# EasyEDA schematic SCH_New-Project_2024-05-19.json
TITLE: Sheet_1; REV: 1.0; Date: 2024-03-19; Sheet: 1/1; Drawn By: qwsa1223; Company: Your Company
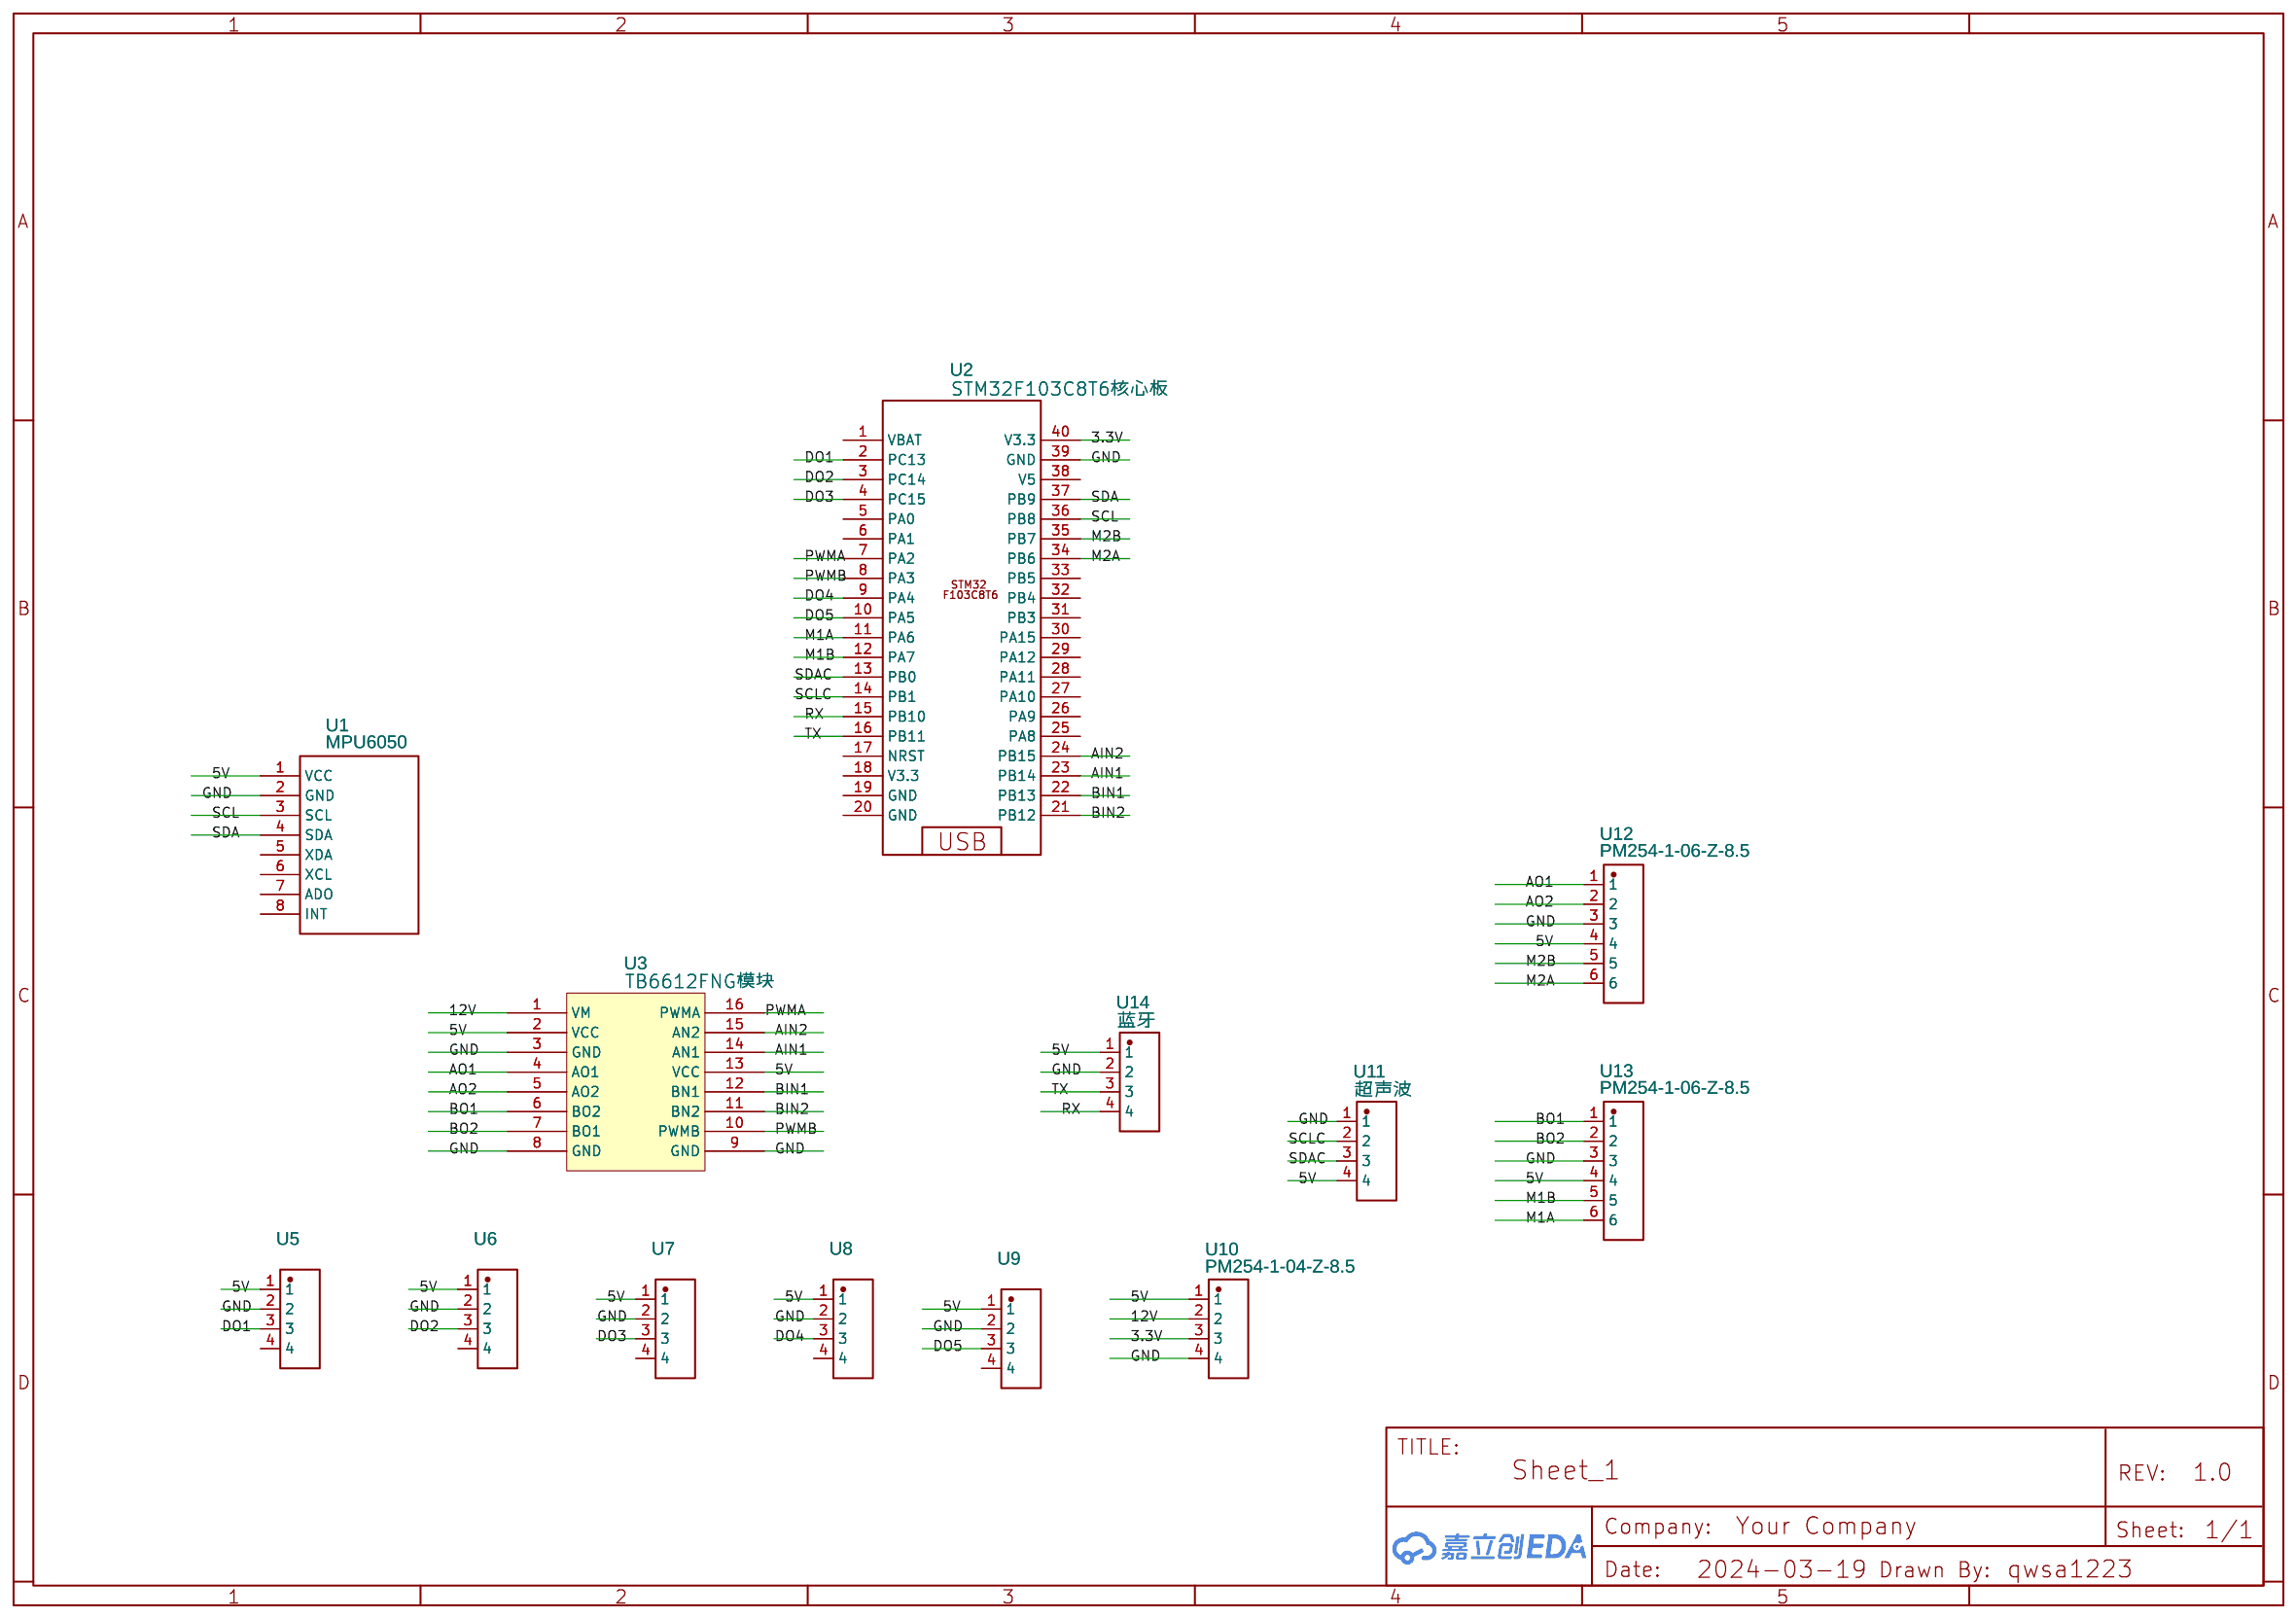
[diagram p0: schematic sheet]

## Parts
U1  MPU6050  [MPU6050]
U2  STM32F103C8T6核心板  [STM32F103C8T6核心板]
U3  TB6612FNG模块  [TB6612FNC]
U5  PM254-1-04-W-8.5  [HDR-TH_4P-P2.54-H-F-W10.0-N]
U6  PM254-1-04-W-8.5  [HDR-TH_4P-P2.54-H-F-W10.0-N]
U7  PM254-1-04-W-8.5  [HDR-TH_4P-P2.54-H-F-W10.0-N]
U8  PM254-1-04-W-8.5  [HDR-TH_4P-P2.54-H-F-W10.0-N]
U9  PM254-1-04-W-8.5  [HDR-TH_4P-P2.54-H-F-W10.0-N]
U10  PM254-1-04-Z-8.5  [HDR-TH_4P-P2.54-V-F]
U11  超声波  [HDR-TH_4P-P2.54-V-F]
U12  PM254-1-06-Z-8.5  [HDR-TH_6P-P2.54-V-F]
U13  PM254-1-06-Z-8.5  [HDR-TH_6P-P2.54-V-F]
U14  蓝牙  [HDR-TH_4P-P2.54-V-F]

## Library data of the parts
U1 = MPU6050: Contributor: LIbaiMaotai
U2 = STM32F103C8T6核心板: Contributor: Joe0011
U3 = TB6612FNG模块: Contributor: dxydxy
U5-U9 = PM254-1-04-W-8.5: Contributor: LCSC; Supplier: LCSC; Supplier Part: C2897386; Manufacturer: HCTL(华灿天禄); JLCPCB Part Class: Extended Part
U10 U11 U14 = PM254-1-04-Z-8.5: Contributor: LCSC; Supplier: LCSC; Supplier Part: C2897367; Manufacturer: HCTL(华灿天禄); JLCPCB Part Class: Extended Part
U12 U13 = PM254-1-06-Z-8.5: Contributor: LCSC; Supplier: LCSC; Supplier Part: C2897369; Manufacturer: HCTL(华灿天禄); JLCPCB Part Class: Extended Part

## Nets
3.3V: U2.40(V3.3) U10.3
5V: U1.1(VCC) U3.2(VCC) U3.13(VCC) U5.1 U6.1 U7.1 U8.1 U9.1 U10.1 U11.4 U12.4 U13.4 U14.1
12V: U3.1(VM) U10.2
GND: U1.2(GND) U2.39(GND) U3.3(GND) U3.8(GND) U3.9(GND) U5.2 U6.2 U7.2 U8.2 U9.2 U10.4 U11.1 U12.3 U13.3 U14.2
AIN1: U2.23(PB14) U3.14(AN1)
AIN2: U2.24(PB15) U3.15(AN2)
AO1: U3.4(AO1) U12.1
AO2: U3.5(AO2) U12.2
BIN1: U2.22(PB13) U3.12(BN1)
BIN2: U2.21(PB12) U3.11(BN2)
BO1: U3.6(BO2) U13.1
BO2: U3.7(BO1) U13.2
DO1: U2.2(PC13) U5.3
DO2: U2.3(PC14) U6.3
DO3: U2.4(PC15) U7.3
DO4: U2.9(PA4) U8.3
DO5: U2.10(PA5) U9.3
M1A: U2.11(PA6) U13.6
M1B: U2.12(PA7) U13.5
M2A: U2.34(PB6) U12.6
M2B: U2.35(PB7) U12.5
PWMA: U2.7(PA2) U3.16(PWMA)
PWMB: U2.8(PA3) U3.10(PWMB)
RX: U2.15(PB10) U14.4
SCL: U1.3(SCL) U2.36(PB8)
SCLC: U2.14(PB1) U11.2
SDA: U1.4(SDA) U2.37(PB9)
SDAC: U2.13(PB0) U11.3
TX: U2.16(PB11) U14.3

Not connected (* = marked no-connect by the designer): U1 5(XDA) 6(XCL) 7(ADO) 8(INT); U2 1(VBAT) 5(PA0) 6(PA1) 17(NRST) 18(V3.3) 19(GND) 20(GND) 25(PA8) 26(PA9) 27(PA10) 28(PA11) 29(PA12) 30(PA15) 31(PB3) 32(PB4) 33(PB5) 38(V5); U5 4; U6 4; U7 4; U8 4; U9 4
